# Altium project TD.0002-100.PrjPcb
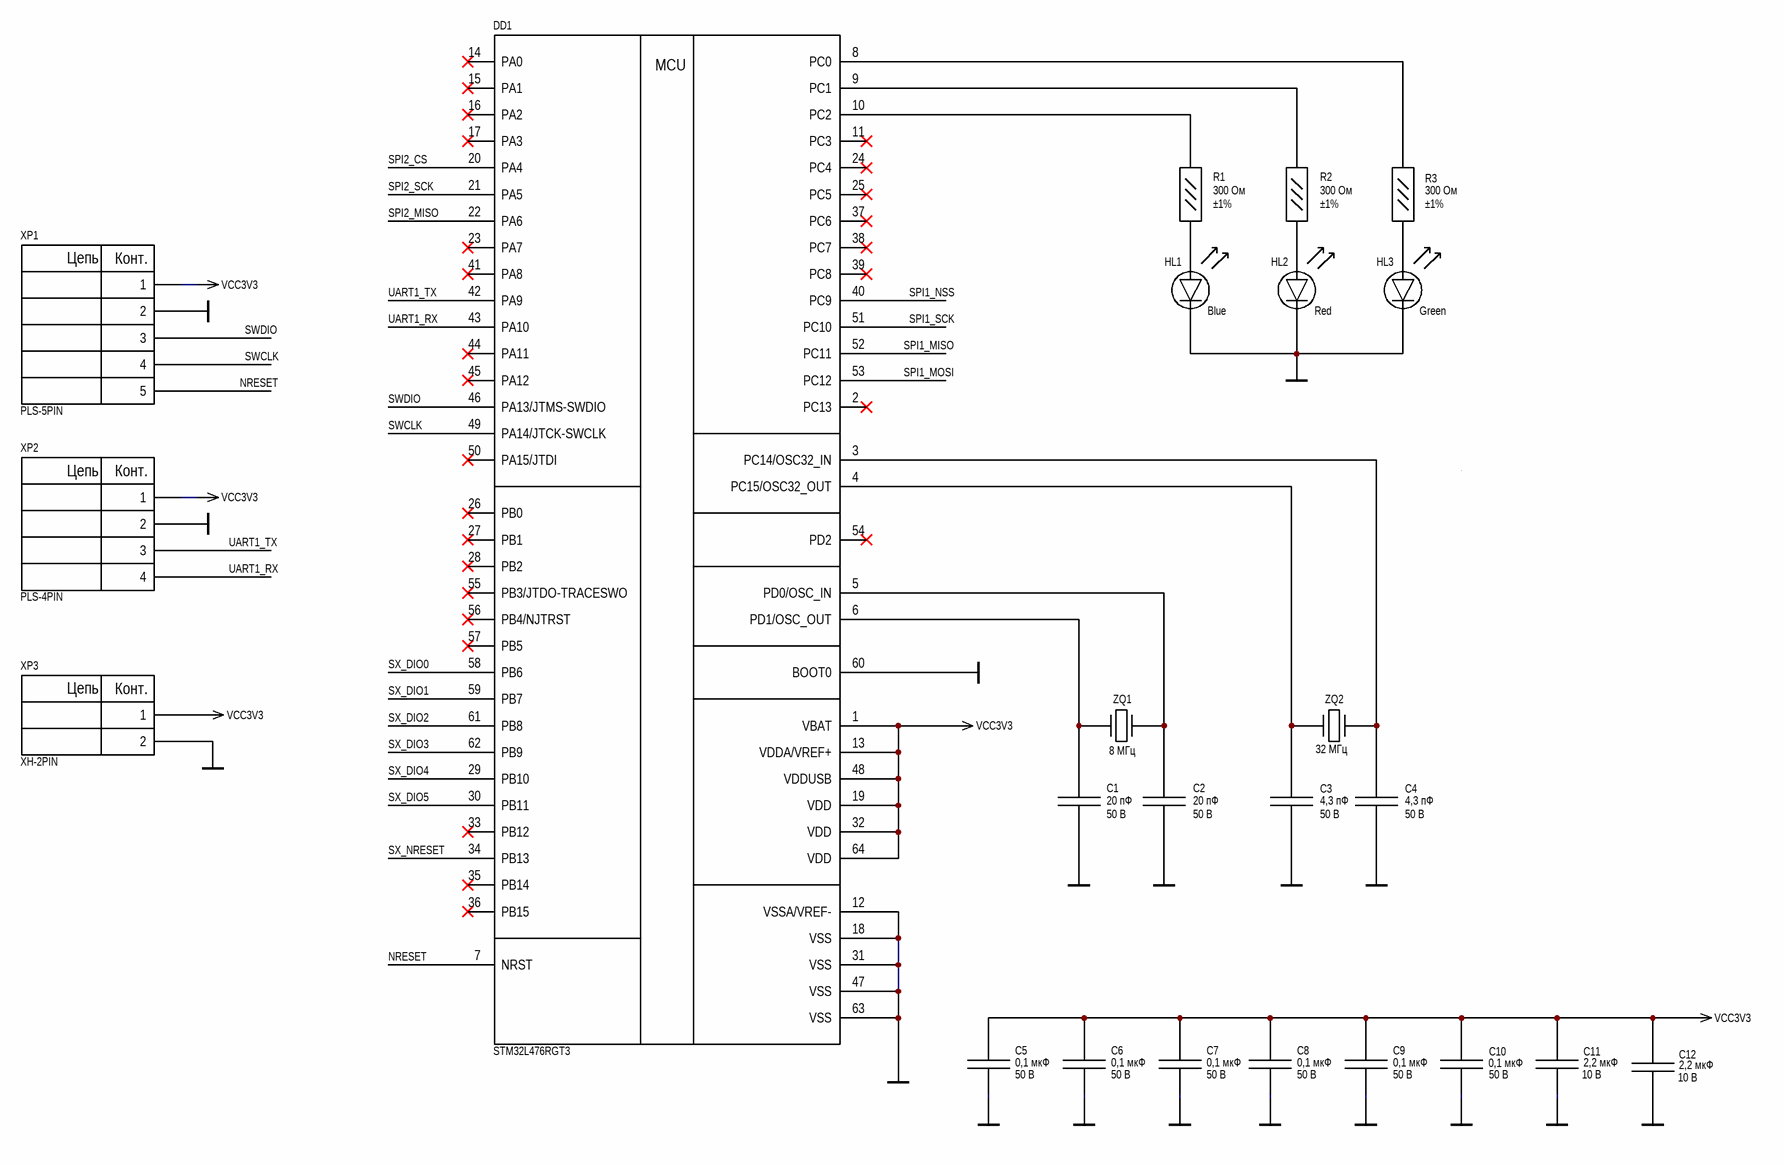
[diagram p0: TD.0002-100_1.SchDoc]
ApprovedBy: Шаршавин; CheckedBy: Новиков; DocumentNumber: TD.0002-100; DrawnBy: Куанышбаев; NormInspection: Шаршавин; Organization: ТОО «IoT Systems»; PcbNumber: TD.0002-101; ProcessInspection: Новиков; Title: МПП-1
3 sheets, 57 parts. Net scope: global (net labels, ports and power ports of the same name join across sheets).
Board file: TD.0002-101.PcbDoc
Sheets:
  TD.0002-100_1.SchDoc
  TD.0002-100_2.SchDoc
  TD.0002-100_3.SchDoc

## Sheet TD.0002-100_1.SchDoc: ДТТ-1
size 420 x 297 mm; ApprovedBy: Маханов; CheckedBy: Айкеева; Organization: РЭТ-41; SheetNumber: 1; SheetTotal: 3; ProcessInspection: Айкеева; NormInspection: Мухамедрах.

### Parts
C1  value 20 пФ  Voltage: 50 В  [C_0402]  (hidden comment: GCM1555C1H200JA16)
C2  value 20 пФ  Voltage: 50 В  [C_0402]  (hidden comment: GCM1555C1H200JA16)
C3  value 4,3 пФ  Voltage: 50 В  [C_0402]  (hidden comment: GCM1555C1H4R3BA16)
C4  value 4,3 пФ  Voltage: 50 В  [C_0402]  (hidden comment: GCM1555C1H4R3BA16)
C5  value 0,1 мкФ  Voltage: 50 В  [C_0402]  (hidden comment: GRM155R71H104KE14)
C6  value 0,1 мкФ  Voltage: 50 В  [C_0402]  (hidden comment: GRM155R71H104KE14)
C7  value 0,1 мкФ  Voltage: 50 В  [C_0402]  (hidden comment: GRM155R71H104KE14)
C8  value 0,1 мкФ  Voltage: 50 В  [C_0402]  (hidden comment: GRM155R71H104KE14)
C9  value 0,1 мкФ  Voltage: 50 В  [C_0402]  (hidden comment: GRM155R71H104KE14)
C10  value 0,1 мкФ  Voltage: 50 В  [C_0402]  (hidden comment: GRM155R71H104KE14)
C11  value 2,2 мкФ  Voltage: 10 В  [C_0402]  (hidden comment: GRM155C81A225ME44)
C12  value 2,2 мкФ  Voltage: 10 В  [C_0402]  (hidden comment: GRM155C81A225ME44)
DD1  STM32L476RGT3  [LQFP_64]
HL1  Color: Blue  [LED_0805_BLUE]  (hidden comment: TO-2013BC-BF)
HL2  Color: Red  [LED_0805_RED]  (hidden comment: TO-2013BC-MRE)
HL3  Color: Green  [LED_0805_GREEN]  (hidden comment: TO-2013BC-PG)
R1  value 300 Ом  Accuracy: ±1%  [R_0402]  (hidden comment: RC0100FR-07300RP)
R2  value 300 Ом  Accuracy: ±1%  [R_0402]  (hidden comment: RC0100FR-07300RP)
R3  value 300 Ом  Accuracy: ±1%  [R_0402]  (hidden comment: RC0100FR-07300RP)
XP1  PLS-5PIN  [PLS-5PIN]
XP2  PLS-4PIN  [PLS-4PIN]
XP3  XH-2PIN  [XH-2PIN]
ZQ1  value 8 МГц  [CM9V-T1A]  (hidden comment: Quartz)
ZQ2  value 32 МГц  [CM9V-T1A]  (hidden comment: Quartz)

### Nets
GND: C1.2 C2.2 C3.2 C4.2 C5.2 C6.2 C7.2 C8.2 C9.2 C10.2 C11.2 C12.2 DD1.12(VSSA/VREF-) DD1.18(VSS) DD1.31(VSS) DD1.47(VSS) DD1.60(BOOT0) DD1.63(VSS) HL1.2 HL2.2 HL3.2 XP1.2 XP2.2 XP3.2
VCC3V3: C5.1 C6.1 C7.1 C8.1 C9.1 C10.1 C11.1 C12.1 DD1.1(VBAT) DD1.13(VDDA/VREF+) DD1.19(VDD) DD1.32(VDD) DD1.48(VDDUSB) DD1.64(VDD) XP1.1 XP2.1 XP3.1
NRESET: DD1.7(NRST) XP1.5
SPI1_MISO: DD1.52(PC11)
SPI1_MOSI: DD1.53(PC12)
SPI1_NSS: DD1.40(PC9)
SPI1_SCK: DD1.51(PC10)
SPI2_CS: DD1.20(PA4)
SPI2_MISO: DD1.22(PA6)
SPI2_SCK: DD1.21(PA5)
SWCLK: DD1.49(PA14/JTCK-SWCLK) XP1.4
SWDIO: DD1.46(PA13/JTMS-SWDIO) XP1.3
SX_DIO0: DD1.58(PB6)
SX_DIO1: DD1.59(PB7)
SX_DIO2: DD1.61(PB8)
SX_DIO3: DD1.62(PB9)
SX_DIO4: DD1.29(PB10)
SX_DIO5: DD1.30(PB11)
SX_NRESET: DD1.34(PB13)
UART1_RX: DD1.43(PA10) XP2.4
UART1_TX: DD1.42(PA9) XP2.3
NetC1_1: C1.1 DD1.6(PD1/OSC_OUT) ZQ1.2(XO)
NetC2_1: C2.1 DD1.5(PD0/OSC_IN) ZQ1.1(XI)
NetC3_1: C3.1 DD1.4(PC15/OSC32_OUT) ZQ2.1(XI)
NetC4_1: C4.1 DD1.3(PC14/OSC32_IN) ZQ2.2(XO)
NetDD1_8: DD1.8(PC0) R3.2
NetDD1_9: DD1.9(PC1) R2.2
NetDD1_10: DD1.10(PC2) R1.2
NetHL1_1: HL1.1 R1.1
NetHL2_1: HL2.1 R2.1
NetHL3_1: HL3.1 R3.1

Not connected (* = marked no-connect by the designer): DD1 2(PC13)* 11(PC3)* 14(PA0)* 15(PA1)* 16(PA2)* 17(PA3)* 23(PA7)* 24(PC4)* 25(PC5)* 26(PB0)* 27(PB1)* 28(PB2)* 33(PB12)* 35(PB14)* 36(PB15)* 37(PC6)* 38(PC7)* 39(PC8)* 41(PA8)* 44(PA11)* 45(PA12)* 50(PA15/JTDI)* 54(PD2)* 55(PB3/JTDO-TRACESWO)* 56(PB4/NJTRST)* 57(PB5)*

### Notes on the sheet
- Перв. примен.
- Справ. №
- Подп. и дата
- Инв. № дубл.
- Взам. инв. №
- Изм.
- Лист
- № докум.
- Подп.
- Дата
- Лит.
- Масса
- Масштаб
- Т.контр.
- Пров.
- Разраб.
- Листов
- Инв. № подл.
- Н.контр.
- Утв.
- Копировал
- Формат А3
- (in symbol PLS-4PIN) Цепь; Конт.
- (in symbol PLS-5PIN) Цепь; Конт.
- (in symbol STM32L476RGT3) MCU
- (in symbol XH-2PIN) Цепь; Конт.

### Library data of the parts
C1 C2 = GCM1555C1H200JA16: Chip Multilayer Ceramic Capacitor; Manufacturer: Murata; TC: C0G; Tolerance: ±5%; Type: Конденсатор керамический; Operating temperature: -55 … 125 °C; Part Number: GCM1555C1H200JA16; Library Ref: *; Library Path: *; Package: SMD 0402; Temperature coefficient: *
C3 C4 = GCM1555C1H4R3BA16: Chip Multilayer Ceramic Capacitor; Manufacturer: Murata; TC: C0G; Tolerance: ±0,1 пФ; Type: Конденсатор керамический; Operating temperature: -55 … 125 °C; Part Number: GCM1555C1H4R3BA16; Library Ref: *; Library Path: *; Package: SMD 0402; Temperature coefficient: *
C5-C10 = GRM155R71H104KE14: Chip Multilayer Ceramic Capacitor; Manufacturer: Murata; TC: X7R; Tolerance: ±10%; Type: Конденсатор керамический; Operating temperature: -55 … 125 °C; Part Number: GRM155R71H104KE14; Library Ref: *; Library Path: *; Package: SMD 0402; Temperature coefficient: *
C11 C12 = GRM155C81A225ME44: Chip Multilayer Ceramic Capacitor; Manufacturer: Murata; TC: X6S; Tolerance: ±20%; Type: Конденсатор керамический; Operating temperature: -55 … 105 °C; Part Number: GRM155C81A225ME44; Library Ref: *; Library Path: *; Package: SMD 0402; Temperature coefficient: *
DD1 = STM32L476RGT3: Manufacturer: STMicroelectronics; Supply voltage: 1,71 ... 3,6 V; SRAM: 1 KB; Flash memory: 1 MB; Cystal oscillator: 4 ... 48 MHz; Type: Microcontroller; Temperature range: -40 ... +125 ºC
HL1 = TO-2013BC-BF: Светодиод синий; Manufacturer: OASISTEK; Value: 20 мА; Wavelength: 468 нм; Type: SMD; Part Number: TO-2013BC-BF; Package: SMD 0805
HL2 = TO-2013BC-MRE: Светодиод красный; Manufacturer: OASISTEK; Value: 20 мА; Wavelength: 630 нм; Type: SMD; Part Number: TO-2013BC-MRE; Package: SMD 0805
HL3 = TO-2013BC-PG: Светодиод зеленый; Manufacturer: OASISTEK; Value: 20 мА; Wavelength: 525 нм; Type: SMD; Part Number: TO-2013BC-PG; Package: SMD 0805
R1-R3 = RC0100FR-07300RP: General Purpose; Manufacturer: Yageo; Voltage: 15 В; Power dissipation: *; Part Number: RC0100FR-07300RP; Package: SMD 0402; Operating temperature: -55 … 125 °C; Type: Толстопленочный
XP1 = PLS-5PIN: Contact step: 2,54 mm
XP2 = PLS-4PIN: Contact step: 2,54 mm
XP3 = XH-2PIN: Manufaturer: JST; Voltage: 250 V; Current: 3 A; Contact step: 2,54 mm; Type: Connector

## Sheet TD.0002-100_2.SchDoc: ДТТ-1
size 420 x 297 mm; ApprovedBy: Маханов; CheckedBy: Айкеева; Organization: РЭТ-41; SheetNumber: 2; SheetTotal: 3; ProcessInspection: Айкеева; NormInspection: Мухамедрахимова
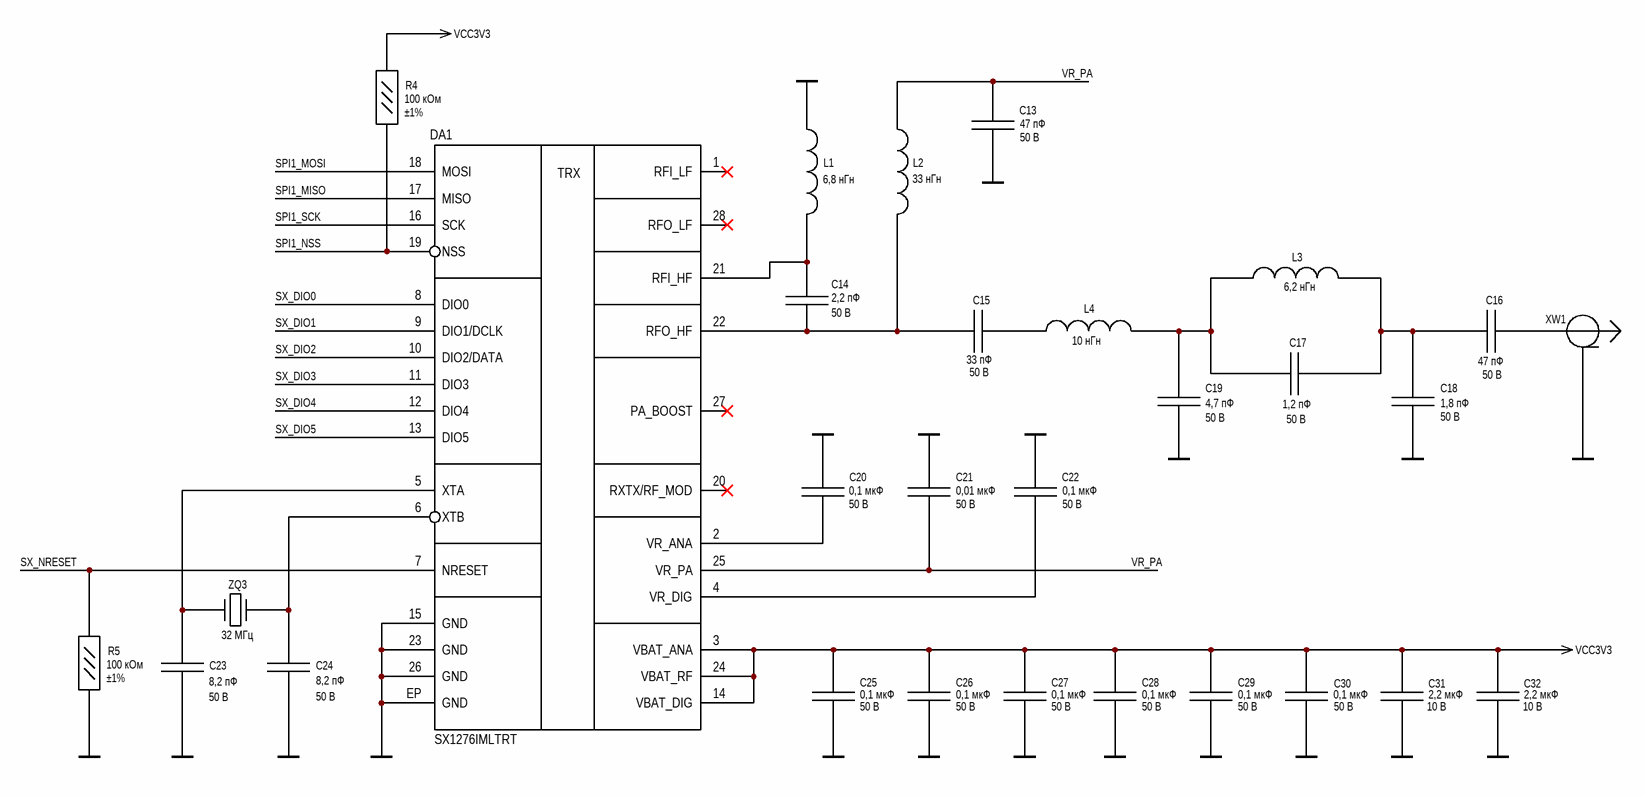
[diagram p1: TD.0002-100_2.SchDoc]

### Parts
C13  value 47 пФ  Voltage: 50 В  [C_0402]  (hidden comment: GRM1555C1H470GA01)
C14  value 2,2 пФ  Voltage: 50 В  [C_0402]  (hidden comment: GRM1555C1H2R2CA01)
C15  value 33 пФ  Voltage: 50 В  [C_0402]  (hidden comment: GRM1555C1H330GA01)
C16  value 47 пФ  Voltage: 50 В  [C_0402]  (hidden comment: GRM1555C1H470GA01)
C17  value 1,2 пФ  Voltage: 50 В  [C_0402]  (hidden comment: GRM1555C1H1R2CA01)
C18  value 1,8 пФ  Voltage: 50 В  [C_0402]  (hidden comment: GRM1555C1H1R8CA01)
C19  value 4,7 пФ  Voltage: 50 В  [C_0402]  (hidden comment: GRM1555C1H4R7CA01)
C20  value 0,1 мкФ  Voltage: 50 В  [C_0402]  (hidden comment: GRM155R71H104KE14)
C21  value 0,01 мкФ  Voltage: 50 В  [C_0402]  (hidden comment: GRM155R71H103KA88)
C22  value 0,1 мкФ  Voltage: 50 В  [C_0402]  (hidden comment: GRM155R71H104KE14)
C23  value 8,2 пФ  Voltage: 50 В  [C_0402]  (hidden comment: GRM1555C1H8R2WA01)
C24  value 8,2 пФ  Voltage: 50 В  [C_0402]  (hidden comment: GRM1555C1H8R2WA01)
C25  value 0,1 мкФ  Voltage: 50 В  [C_0402]  (hidden comment: GRM155R71H104KE14)
C26  value 0,1 мкФ  Voltage: 50 В  [C_0402]  (hidden comment: GRM155R71H104KE14)
C27  value 0,1 мкФ  Voltage: 50 В  [C_0402]  (hidden comment: GRM155R71H104KE14)
C28  value 0,1 мкФ  Voltage: 50 В  [C_0402]  (hidden comment: GRM155R71H104KE14)
C29  value 0,1 мкФ  Voltage: 50 В  [C_0402]  (hidden comment: GRM155R71H104KE14)
C30  value 0,1 мкФ  Voltage: 50 В  [C_0402]  (hidden comment: GRM155R71H104KE14)
C31  value 2,2 мкФ  Voltage: 10 В  [C_0402]  (hidden comment: GRM155C81A225ME44)
C32  value 2,2 мкФ  Voltage: 10 В  [C_0402]  (hidden comment: GRM155C81A225ME44)
DA1  SX1276IMLTRT  [QFN_28]
L1  value 6,8 нГн  [L_0402]  (hidden comment: LQW15AN6N8G80)
L2  value 33 нГн  [L_0402]  (hidden comment: LQW15AN33NJ00)
L3  value 6,2 нГн  [L_0402]  (hidden comment: LQW15AN6N2G8Z)
L4  value 10 нГн  [L_0402]  (hidden comment: LQW15AN10NG80)
R4  value 100 кОм  Accuracy: ±1%  [R_0402]  (hidden comment: RC0402FR-07100KL)
R5  value 100 кОм  Accuracy: ±1%  [R_0402]  (hidden comment: RC0402FR-07100KL)
XW1  U.FL-R-SMT  [U.FL-R-SMT]  (value not drawn)
ZQ3  value 32 МГц  [CM9V-T1A]  (hidden comment: Quartz)

### Nets
GND: C13.2 C18.2 C19.2 C20.1 C21.1 C22.1 C23.2 C24.2 C25.2 C26.2 C27.2 C28.2 C29.2 C30.2 C31.2 C32.2 DA1.15(GND) DA1.23(GND) DA1.26(GND) DA1.EP(GND) L1.1 R5.1 XW1.2(GND)
VCC3V3: C25.1 C26.1 C27.1 C28.1 C29.1 C30.1 C31.1 C32.1 DA1.3(VBAT_ANA) DA1.14(VBAT_DIG) DA1.24(VBAT_RF) R4.2
SPI1_MISO: DA1.17(MISO)
SPI1_MOSI: DA1.18(MOSI)
SPI1_NSS: DA1.19(NSS) R4.1
SPI1_SCK: DA1.16(SCK)
SX_DIO0: DA1.8(DIO0)
SX_DIO1: DA1.9(DIO1/DCLK)
SX_DIO2: DA1.10(DIO2/DATA)
SX_DIO3: DA1.11(DIO3)
SX_DIO4: DA1.12(DIO4)
SX_DIO5: DA1.13(DIO5)
SX_NRESET: DA1.7(NRESET) R5.2
VR_PA: C13.1 C21.2 DA1.25(VR_PA) L2.1
NetC14_1: C14.1 DA1.21(RFI_HF) L1.2
NetC14_2: C14.2 C15.1 DA1.22(RFO_HF) L2.2
NetC15_2: C15.2 L4.1
NetC16_1: C16.1 C17.2 C18.1 L3.2
NetC16_2: C16.2 XW1.1(SIGNAL)
NetC17_1: C17.1 C19.1 L3.1 L4.2
NetC20_2: C20.2 DA1.2(VR_ANA)
NetC22_2: C22.2 DA1.4(VR_DIG)
NetC23_1: C23.1 DA1.5(XTA) ZQ3.1(XI)
NetC24_1: C24.1 DA1.6(XTB) ZQ3.2(XO)

Not connected (* = marked no-connect by the designer): DA1 1(RFI_LF)* 20(RXTX/RF_MOD)* 27(PA_BOOST)* 28(RFO_LF)*

### Notes on the sheet
- Перв. примен.
- Справ. №
- Подп. и дата
- Инв. № дубл.
- Взам. инв. №
- Изм.
- Лист
- № докум.
- Подп.
- Дата
- Лит.
- Масса
- Масштаб
- Т.контр.
- Пров.
- Разраб.
- Листов
- Инв. № подл.
- Н.контр.
- Утв.
- Копировал
- Формат А3
- (in symbol SX1276IMLTRT) TRX

### Library data of the parts
C13 C16 = GRM1555C1H470GA01: Chip Multilayer Ceramic Capacitor; Manufacturer: Murata; TC: C0G; Tolerance: ±2%; Type: Конденсатор керамический; Operating temperature: -55 … 125 °C; Part Number: GRM1555C1H470GA01; Library Ref: *; Library Path: *; Package: SMD 0402; Temperature coefficient: *
C14 = GRM1555C1H2R2CA01: Chip Multilayer Ceramic Capacitor; Manufacturer: Murata; TC: C0G; Tolerance: ±0,25 пФ; Type: Конденсатор керамический; Operating temperature: -55 … 125 °C; Part Number: GRM1555C1H2R2CA01; Library Ref: *; Library Path: *; Package: SMD 0402; Temperature coefficient: *
C15 = GRM1555C1H330GA01: Chip Multilayer Ceramic Capacitor; Manufacturer: Murata; TC: C0G; Tolerance: ±2%; Type: Конденсатор керамический; Operating temperature: -55 … 125 °C; Part Number: GRM1555C1H330GA01; Library Ref: *; Library Path: *; Package: SMD 0402; Temperature coefficient: *
C17 = GRM1555C1H1R2CA01: Chip Multilayer Ceramic Capacitor; Manufacturer: Murata; TC: C0G; Tolerance: ±0,25 пФ; Type: Конденсатор керамический; Operating temperature: -55 … 125 °C; Part Number: GRM1555C1H1R2CA01; Library Ref: *; Library Path: *; Package: SMD 0402; Temperature coefficient: *
C18 = GRM1555C1H1R8CA01: Chip Multilayer Ceramic Capacitor; Manufacturer: Murata; TC: C0G; Tolerance: ±0,25 пФ; Type: Конденсатор керамический; Operating temperature: -55 … 125 °C; Part Number: GRM1555C1H1R8CA01; Library Ref: *; Library Path: *; Package: SMD 0402; Temperature coefficient: *
C19 = GRM1555C1H4R7CA01: Chip Multilayer Ceramic Capacitor; Manufacturer: Murata; TC: C0G; Tolerance: ±0,25 пФ; Type: Конденсатор керамический; Operating temperature: -55 … 125 °C; Part Number: GRM1555C1H4R7CA01; Library Ref: *; Library Path: *; Package: SMD 0402; Temperature coefficient: *
C20 C22 C25-C30 = GRM155R71H104KE14: as C5 on sheet TD.0002-100_1; Operating temperature: -55 … 125 °C; Part Number: GRM155R71H104KE14; Library Ref: *; Library Path: *; Package: SMD 0402; Temperature coefficient: *
C21 = GRM155R71H103KA88: Chip Multilayer Ceramic Capacitor; Manufacturer: Murata; TC: X7R; Tolerance: ±10%; Type: Конденсатор керамический; Operating temperature: -55 … 125 °C; Part Number: GRM155R71H103KA88; Library Ref: *; Library Path: *; Package: SMD 0402; Temperature coefficient: *
C23 C24 = GRM1555C1H8R2WA01: Chip Multilayer Ceramic Capacitor; Manufacturer: Murata; TC: C0G; Tolerance: ±0,05 пФ; Type: Конденсатор керамический; Operating temperature: -55 … 125 °C; Part Number: GRM1555C1H8R2WA01; Library Ref: *; Library Path: *; Package: SMD 0402; Temperature coefficient: *
C31 C32 = GRM155C81A225ME44: as C11 on sheet TD.0002-100_1; Operating temperature: -55 … 105 °C; Part Number: GRM155C81A225ME44; Library Ref: *; Library Path: *; Package: SMD 0402; Temperature coefficient: *
DA1 = SX1276IMLTRT: 860 MHz to 1020 MHz Low Power Long Range Transceiver; Manufacturer: Semtech; Supply voltage: 1,8 ... 3,7 В; Interface: SPI; Baudrate: 1,7 ... 300 кбит/с; Modulation: GFSK/FSK/GMSK/MSK/OOK/LoRa; Frequency range: 137 ... 1020 MHz; Type: Transceiver RF; Temperature range: -40 ... +85 °C
L1 = LQW15AN6N8G80: Manufacturer: Murata; Current: 1450 мА; Tolerance: ±2%; Type: Катушки постоянной индуктивности; Part Number: LQW15AN6N8G80; Package: SMD 0402; Operating temperature: -55 … 125 °C; Library Ref: *; Footprint Ref: *; Library Path: *; Footprint Path: *
L2 = LQW15AN33NJ00: Manufacturer: Murata; Current: 260 мА; Tolerance: ±5%; Type: Катушки постоянной индуктивности; Part Number: LQW15AN33NJ00; Package: SMD 0402; Operating temperature: -55 … 125 °C; Library Ref: *; Footprint Ref: *; Library Path: *; Footprint Path: *
L3 = LQW15AN6N2G8Z: Manufacturer: Murata; Current: 1600 мА; Tolerance: ±2%; Type: Катушки постоянной индуктивности; Part Number: LQW15AN6N2G8Z; Package: SMD 0402; Operating temperature: -55 … 125 °C; Library Ref: *; Footprint Ref: *; Library Path: *; Footprint Path: *
L4 = LQW15AN10NG80: Manufacturer: Murata; Current: 1400 мА; Tolerance: ±2%; Type: Катушки постоянной индуктивности; Part Number: LQW15AN10NG80; Package: SMD 0402; Operating temperature: -55 … 125 °C; Library Ref: *; Footprint Ref: *; Library Path: *; Footprint Path: *
R4 R5 = RC0402FR-07100KL: High Reliability; Manufacturer: Yageo; Voltage: 50 В; Power dissipation: *; Part Number: RC0402FR-07100KL; Package: SMD 0402; Operating temperature: -55 … 155 °C; Type: Толстопленочный
XW1 = U.FL-R-SMT: Manufacturer: Hirose Electric; Maximum frequency: 6 GHz; Wave resistance: 50 Ohm; Type: Connector; Operating temperature range: -40 ... +90 ºC

## Sheet TD.0002-100_3.SchDoc: ДТТ-1
size 420 x 297 mm; ApprovedBy: Маханов; CheckedBy: Айкеева; Organization: РЭТ-41; SheetNumber: 3; SheetTotal: 3; ProcessInspection: Айкеева; NormInspection: Мухамедрахимова
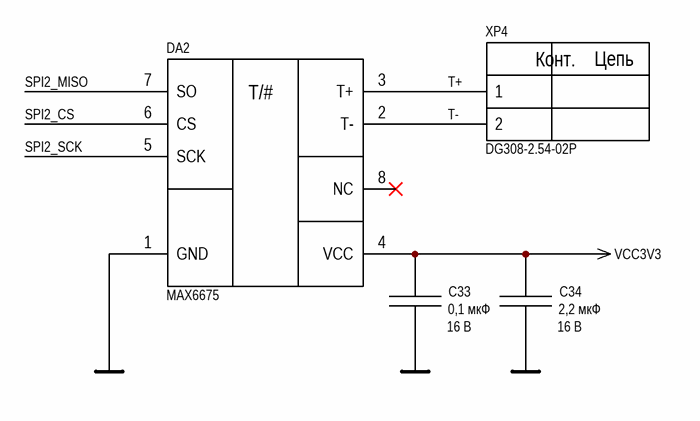
[diagram p2: TD.0002-100_3.SchDoc]

### Parts
C33  value 0,1 мкФ  Voltage: 16 В  [C_0402]  (hidden comment: GRM155R61C104KA88)
C34  value 2,2 мкФ  Voltage: 16 В  [C_0402]  (hidden comment: GRM155R61C225KE11)
DA2  MAX6675  [SOIC-8]
XP4  DG308-2.54-02P  [Terminal_Block_2PIN]

### Nets
GND: C33.2 C34.2 DA2.1(GND)
VCC3V3: C33.1 C34.1 DA2.4(VCC)
SPI2_CS: DA2.6(CS)
SPI2_MISO: DA2.7(SO)
SPI2_SCK: DA2.5(SCK)
T+: DA2.3(T+) XP4.1
T-: DA2.2(T-) XP4.2

Not connected (* = marked no-connect by the designer): DA2 8(NC)*

### Notes on the sheet
- (near DA2) T/#
- Перв. примен.
- Справ. №
- Подп. и дата
- Инв. № дубл.
- Взам. инв. №
- Изм.
- Лист
- № докум.
- Подп.
- Дата
- Лит.
- Масса
- Масштаб
- Т.контр.
- Пров.
- Разраб.
- Листов
- Инв. № подл.
- Н.контр.
- Утв.
- Копировал
- Формат А3
- (in symbol DG308-2.54-02P-14-00AH) Конт.; Цепь

### Library data of the parts
C33 = GRM155R61C104KA88: Chip Multilayer Ceramic Capacitor; Manufacturer: Murata; TC: X5R; Tolerance: ±10%; Type: Конденсатор керамический; Operating temperature: -55 … 85 °C; Part Number: GRM155R61C104KA88; Library Ref: *; Library Path: *; Package: SMD 0402; Temperature coefficient: *
C34 = GRM155R61C225KE11: Chip Multilayer Ceramic Capacitor; Manufacturer: Murata; TC: X5R; Tolerance: ±10%; Type: Конденсатор керамический; Operating temperature: -55 … 85 °C; Part Number: GRM155R61C225KE11; Library Ref: *; Library Path: *; Package: SMD 0402; Temperature coefficient: *
DA2 = MAX6675: Manufacturer: Maxim Integrated; Measuring range: 0 ... +600/(+1024) ºC; Supply Voltage: -0,3 ... 6 V; SO Current: 50 mA; Type: Thermocouple to Digital Converter; Operating temperature range: -20 ... +85 ºC
XP4 = DG308-2.54-02P-14-00AH: Manufacturer: Dinkle; Voltage: 250 V; Current: 8 A; Contact step: 2.54 mm; Type: Terminal Block; Operating temperature: -30 … 120 ºC

## Nets that join several sheets
GND: TD.0002-100_1 (24 pins), TD.0002-100_2 (23 pins), TD.0002-100_3 (C33.2 C34.2 DA2.1)
VCC3V3: TD.0002-100_1 (17 pins), TD.0002-100_2 (12 pins), TD.0002-100_3 (C33.1 C34.1 DA2.4)
SPI1_MISO: TD.0002-100_1 (DD1.52), TD.0002-100_2 (DA1.17)
SPI1_MOSI: TD.0002-100_1 (DD1.53), TD.0002-100_2 (DA1.18)
SPI1_NSS: TD.0002-100_1 (DD1.40), TD.0002-100_2 (DA1.19 R4.1)
SPI1_SCK: TD.0002-100_1 (DD1.51), TD.0002-100_2 (DA1.16)
SPI2_CS: TD.0002-100_1 (DD1.20), TD.0002-100_3 (DA2.6)
SPI2_MISO: TD.0002-100_1 (DD1.22), TD.0002-100_3 (DA2.7)
SPI2_SCK: TD.0002-100_1 (DD1.21), TD.0002-100_3 (DA2.5)
SX_DIO0: TD.0002-100_1 (DD1.58), TD.0002-100_2 (DA1.8)
SX_DIO1: TD.0002-100_1 (DD1.59), TD.0002-100_2 (DA1.9)
SX_DIO2: TD.0002-100_1 (DD1.61), TD.0002-100_2 (DA1.10)
SX_DIO3: TD.0002-100_1 (DD1.62), TD.0002-100_2 (DA1.11)
SX_DIO4: TD.0002-100_1 (DD1.29), TD.0002-100_2 (DA1.12)
SX_DIO5: TD.0002-100_1 (DD1.30), TD.0002-100_2 (DA1.13)
SX_NRESET: TD.0002-100_1 (DD1.34), TD.0002-100_2 (DA1.7 R5.2)

## Assembly variants
-00: all parts fitted
-01: all parts fitted